# Altium project SensorRPM.PrjPCB
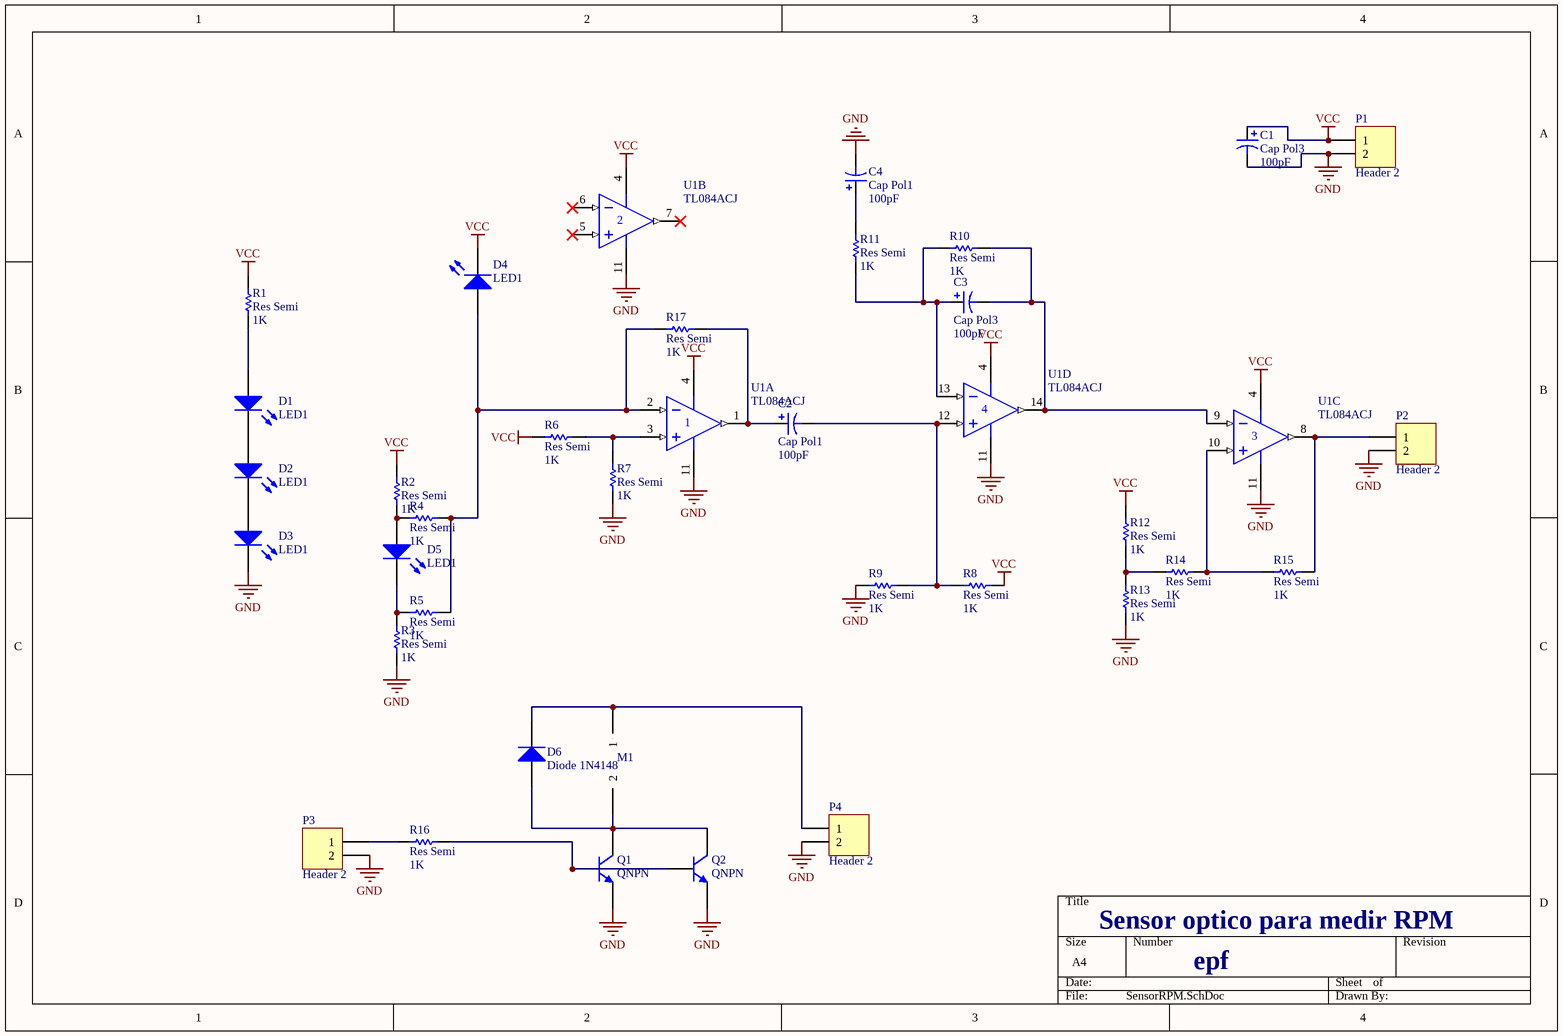
[diagram p0: SensorRPM.SchDoc]
1 sheet, 35 parts. Net scope: global (net labels, ports and power ports of the same name join across sheets).
Board file: Sensor_Motor.PcbDoc

## Sheet SensorRPM.SchDoc
size A4; PageSetup: Record=PageOptions|CenterHorizontal=True|CenterVertical=True|PrintScale=1.00|XCorrection=1.00|YCorrection=1.00|PrintKind=0|BorderSize=5000000|LeftOffset=0|BottomOffset=0|Orientation=2|PaperLength=1000|PaperWidth=1000|Scale=100|PaperSource=7|PrintQuality=-4|MediaType=1|DitherType=10|PaperKind=A4|PrintScaleMode=1

### Parts
C1  Cap Pol3  value 100pF  [C0805]
C2  Cap Pol1  value 100pF  [B]
C3  Cap Pol3  value 100pF  [C0805]
C4  Cap Pol1  value 100pF  [B]
D1  LED1  [LED-1]
D2  LED1  [LED-1]
D3  LED1  [LED-1]
D4  LED1  [LED-1]
D5  LED1  [LED-1]
D6  Diode 1N4148  [DO-35]
M1  Motor  [Motor1]  (value not drawn)
P1  Header 2  [HDR1X2]
P2  Header 2  [HDR1X2]
P3  Header 2  [HDR1X2]
P4  Header 2  [HDR1X2]
Q1  QNPN  [SOT-23B]
Q2  QNPN  [SOT-23B]
R1  Res Semi  value 1K  [2012[0805]]
R2  Res Semi  value 1K  [2012[0805]]
R3  Res Semi  value 1K  [2012[0805]]
R4  Res Semi  value 1K  [2012[0805]]
R5  Res Semi  value 1K  [2012[0805]]
R6  Res Semi  value 1K  [2012[0805]]
R7  Res Semi  value 1K  [2012[0805]]
R8  Res Semi  value 1K  [2012[0805]]
R9  Res Semi  value 1K  [2012[0805]]
R10  Res Semi  value 1K  [2012[0805]]
R11  Res Semi  value 1K  [2012[0805]]
R12  Res Semi  value 1K  [2012[0805]]
R13  Res Semi  value 1K  [2012[0805]]
R14  Res Semi  value 1K  [2012[0805]]
R15  Res Semi  value 1K  [2012[0805]]
R16  Res Semi  value 1K  [2012[0805]]
R17  Res Semi  value 1K  [2012[0805]]
U1  TL084ACJ  [632-08]  (parts A,B,C,D of 4)

### Nets
GND: C1.2 C4.2 D3.2(K) P1.2 P2.2 P3.2 P4.2 Q1.3(E) Q2.3(E) R3.1 R7.2 R9.1 R13.2 U1.11(V-)
VCC: C1.1 D4.2(K) P1.1 R1.2 R2.2 R6.2 R8.2 R12.1 U1.4(V+)
NetC2_1: C2.1 R17.2 U1.1(OUT)
NetC2_2: C2.2 R8.1 R9.2 U1.12(IN+)
NetC3_1: C3.1 R10.1 R11.2 U1.13(IN-)
NetC3_2: C3.2 R10.2 U1.9(IN-) U1.14(OUT)
NetC4_1: C4.1 R11.1
NetD1_1: D1.1(A) R1.1
NetD1_2: D1.2(K) D2.1(A)
NetD2_2: D2.2(K) D3.1(A)
NetD4_1: D4.1(A) R4.1 R5.1 R17.1 U1.2(IN-)
NetD5_1: D5.1(A) R2.1 R4.2
NetD5_2: D5.2(K) R3.2 R5.2
NetD6_1: D6.1(A) M1.2 Q1.1(C) Q2.1(C)
NetD6_2: D6.2(K) M1.1 P4.1
NetP2_1: P2.1 R15.2 U1.8(OUT)
NetP3_1: P3.1 R16.1
NetQ1_2: Q1.2(B) Q2.2(B) R16.2
NetR6_1: R6.1 R7.1 U1.3(IN+)
NetR12_2: R12.2 R13.1 R14.1
NetR14_2: R14.2 R15.1 U1.10(IN+)

Not connected (* = marked no-connect by the designer): U1 5(IN+)* 6(IN-)* 7(OUT)*

### Notes on the sheet
- Sensor optico para medir RPM
- epf

### Library data of the parts
C1 C3 = Cap Pol3: Polarized Capacitor (Surface Mount); Published: 8-Jun-2000; LatestRevisionDate: 17-Jul-2002; LatestRevisionNote: Re-released for DXP Platform.; PackageReference: C0805; Publisher: Altium Limited
C2 C4 = Cap Pol1: Polarized Capacitor (Radial); Published: 8-Jun-2000; LatestRevisionDate: 17-Jul-2002; LatestRevisionNote: Re-released for DXP Platform.; PackageReference: RB7.6-15; Publisher: Altium Limited
D1-D5 = LED1: Typical RED GaAs LED; Published: 8-Jun-2000; LatestRevisionDate: 08-Jul-2005; LatestRevisionNote: Mech Layer 1 removed.; PackageReference: LED-1; Publisher: Altium Limited
D6 = Diode 1N4148: High Conductance Fast Diode; Published: 8-Jun-2000; LatestRevisionDate: 17-Jul-2002; LatestRevisionNote: Re-released for DXP Platform.; DatasheetDocument: 1997; PackageReference: DO-35; Publisher: Altium Limited; Code_JEDEC: DO-204-AH; ComponentLink1Description: Manufacturer Link; ComponentLink1URL: http://www.fairchildsemi.com/; ComponentLink2Description: Datasheet; ComponentLink2URL: http://www.fairchildsemi.com/ds/1N%2F1N4148.pdf
P1-P4 = Header 2: Header, 2-Pin; LatestRevisionDate: 17-Jul-2002; LatestRevisionNote: Re-released for DXP Platform.; Publisher: Altium Limited
Q1 Q2 = QNPN: NPN Bipolar Transistor; pin to pad: 1>3 2>1 3>2; Published: 8-Jun-2000; LatestRevisionDate: 17-Jul-2002; LatestRevisionNote: Re-released for DXP Platform.; PackageReference: SOT-23B; Publisher: Altium Limited; Code_JEDEC: SOT-23
R1-R17 = Res Semi: Semiconductor Resistor; Published: 8-Jun-2000; LatestRevisionDate: 17-Jul-2002; LatestRevisionNote: Re-released for DXP Platform.; PackageReference: AXIAL-0.5; Publisher: Altium Limited
U1 = TL084ACJ: JFET-Input Operational Amplifier; Published: 17-Jul-2002; LatestRevisionDate: 06-Jun-2005; LatestRevisionNote: Stylized 3D Model Added.; DatasheetDocument: 1988; PackageReference: 632-08; Publisher: Altium Limited; ComponentLink1Description: Manufacturer Link; ComponentLink1URL: http://www.onsemi.com/site/products/parametrics/0,4446,251,00.html